# EAGLE design Medir-220-4 (EAGLE 7.2.0)
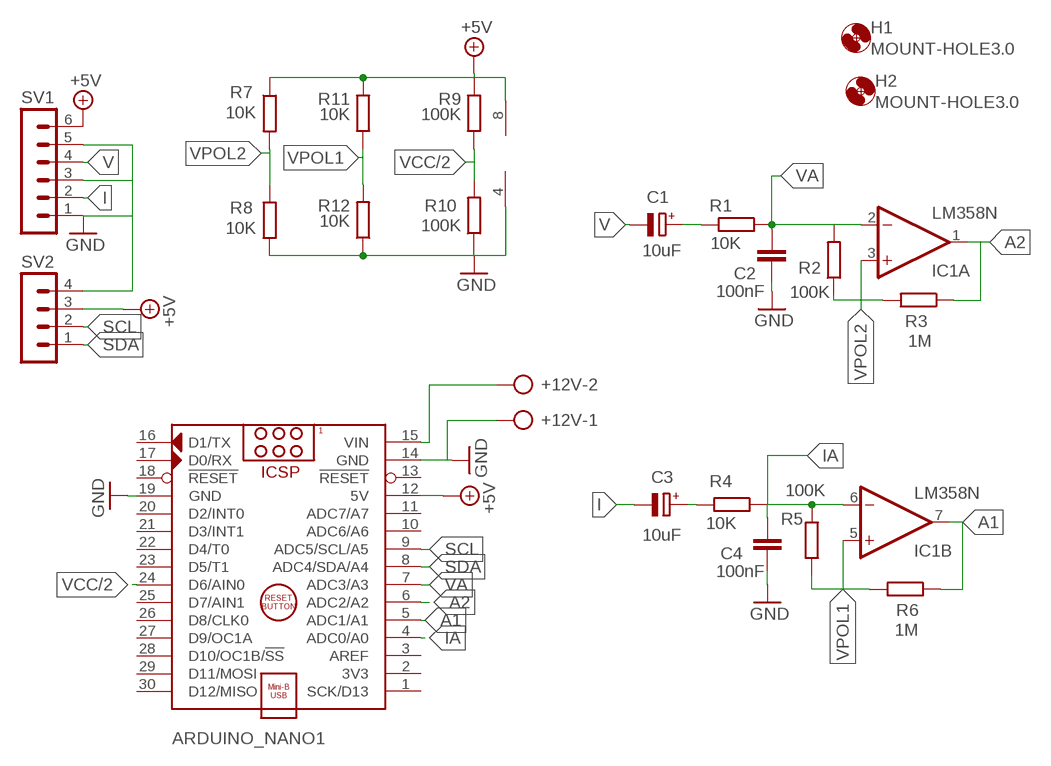
[diagram p0: schematic, sheet 1]

## Parts
+12V  AK500/2  [AK500/2]
ARDUINO_NANO1  ARDUINO_NANO  [ARDUINO_NANO]
C1  10uF  CPOL-EUE2.5-5  [E2,5-5]
C2  100nF  C-EU050-025X075  [C050-025X075]
C3  10uF  CPOL-EUE2.5-5  [E2,5-5]
C4  100nF  C-EU050-025X075  [C050-025X075]
H1  MOUNT-HOLE3.0  [3,0]
H2  MOUNT-HOLE3.0  [3,0]
IC1  LM358N  [DIL08]
R1  10K  R-EU_0207/7  [0207/7]
R2  100K  R-EU_0207/7  [0207/7]
R3  1M  R-EU_0207/7  [0207/7]
R4  10K  R-EU_0207/7  [0207/7]
R5  100K  R-EU_0207/7  [0207/7]
R6  1M  R-EU_0207/7  [0207/7]
R7  10K  R-EU_0207/7  [0207/7]
R8  10K  R-EU_0207/7  [0207/7]
R9  100K  R-EU_0207/10  [0207/10]
R10  100K  R-EU_0207/10  [0207/10]
R11  10K  R-EU_0207/7  [0207/7]
R12  10K  R-EU_0207/7  [0207/7]
SV1  MA06-1  [MA06-1]
SV2  MA04-1  [MA04-1]

## Nets
+5V: ARDUINO_NANO1.12(5V) IC1.8(P:V+) R7.1 R9.2 R11.2 SV1.6 SV2.3
A1: ARDUINO_NANO1.5(ADC1/A1) IC1.7(B:OUT) R6.1
A2: ARDUINO_NANO1.6(ADC2/A2) IC1.1(A:OUT) R3.1
GND: +12V.1 ARDUINO_NANO1.14(GND) ARDUINO_NANO1.19(GND) C2.2 C4.2 IC1.4(P:V-) R8.2 R10.1 R12.1 SV1.1 SV1.3 SV1.5 SV2.4
I: C3.- SV1.2
IA: ARDUINO_NANO1.4(ADC0/A0) C4.1 IC1.6(B:-IN) R4.1 R5.1
N$1: C3.+ R4.2
N$3: C1.+ R1.2
N$4: +12V.2 ARDUINO_NANO1.15(VIN)
SCL: ARDUINO_NANO1.9(ADC5/SCL/A5) SV2.2
SDA: ARDUINO_NANO1.8(ADC4/SDA/A4) SV2.1
V: C1.- SV1.4
VA: ARDUINO_NANO1.7(ADC3/A3) C2.1 IC1.2(A:-IN) R1.1 R2.2
VCC/2: ARDUINO_NANO1.24(D6/AIN0) R9.1 R10.2
VPOL1: IC1.5(B:+IN) R5.2 R6.2 R11.1 R12.2
VPOL2: IC1.3(A:+IN) R2.1 R3.2 R7.2 R8.1
Unconnected: ARDUINO_NANO1.1(SCK/D13) ARDUINO_NANO1.2(3V3) ARDUINO_NANO1.3(AREF) ARDUINO_NANO1.10(ADC6/A6) ARDUINO_NANO1.11(ADC7/A7) ARDUINO_NANO1.13(!RESET) ARDUINO_NANO1.16(D1/TX) ARDUINO_NANO1.17(D0/RX) ARDUINO_NANO1.18(!RESET) ARDUINO_NANO1.20(D2/INT0) ARDUINO_NANO1.21(D3/INT1) ARDUINO_NANO1.22(D4/T0) ARDUINO_NANO1.23(D5/T1) ARDUINO_NANO1.25(D7/AIN1) ARDUINO_NANO1.26(D8/CLK0) ARDUINO_NANO1.27(D9/OC1A) ARDUINO_NANO1.28(D10/OC1B/!SS) ARDUINO_NANO1.29(D11/MOSI) ARDUINO_NANO1.30(D12/MISO)

## Library data of the parts
+12V = con-ptr500:AK500/2: CONNECTOR; OC_FARNELL: unknown; OC_NEWARK: unknown
ARDUINO_NANO1 = ArduinoNanoV30:ARDUINO_NANO: Arduino Nano V3.0 Module Overview: The Arduino Nano is a small, complete, and breadboard-friendly board based on the ATmega328 (Arduino Nano 3.x) or ATmega168 (Arduino Nano 2.x). It has more or less the same functionality of the Arduino Duemilanove, but in a different package. It lacks only a DC power jack, and works with a Mini-B USB cable instead of a standard one. The Nano was designed and is being produced by Gravitech <http://www.gravitech.us/arna30wiatp.html>. General specifications: Item Value Microcontroller Atmel ATmega168 or ATmega328 Operating Voltage (logic level) 5 V Input Voltage (recommended) 7-12 V Input Voltage (limits) 6-20 V Digital I/O Pins 14 (of which 6 provide PWM output) Analog Input Pins 8 DC Current per I/O Pin 40 mA Flash Memory 16 KB (ATmega168) or 32 KB (ATmega328) of which 2 KB used by bootloader SRAM 1 KB (ATmega168) or 2 KB (ATmega328) EEPROM 512 bytes (ATmega168) or 1 KB (ATmega328) Clock Speed 16 MHz Dimensions (Inches) 0.73" x 1.70" Dimensions (mm) 18mm x 45mm Overall height About 9 mm (not including pins) Weigth 5 g Power: The Arduino Nano can be powered via the Mini-B USB connection, 6-20V unregulated external power supply (pin 30), or 5V regulated external power supply (pin 27). The power source is automatically selected to the highest voltage source. Memory: The ATmega168 has 16 KB of flash memory for storing code (of which 2 KB is used for the bootloader); the ATmega328 has 32 KB, (also with 2 KB used for the bootloader). The ATmega168 has 1 KB of SRAM and 512 bytes of EEPROM (which can be read and written with the EEPROM library); the ATmega328 has 2 KB of SRAM and 1 KB of EEPROM. Input and Output: Each of the 14 digital pins on the Nano can be used as an input or output, using pinMode(), digitalWrite(), and digitalRead() functions. They operate at 5 volts. Each pin can provide or receive a maximum of 40 mA and has an internal pull-up resistor (disconnected by default) of 20-50 kOhms. In addition, some pins have specialized functions. Visit Arduino - ArduinoBoardNano <https://www.arduino.cc/en/Main/ArduinoBoardNano>
C1 C3 = rcl:CPOL-EU: POLARIZED CAPACITOR, European symbol
C2 C4 = rcl:C-EU: CAPACITOR, European symbol
H1 H2 = holes:MOUNT-HOLE: MOUNTING HOLE with drill center marker
IC1 = linear:LM358: OP AMP also LM158; LM258; LM2904 Source: http://cache.national.com/ds/LM/LM158.pdf
R1-R8 R11 R12 = resistor:R-EU_: RESISTOR, European symbol
R9 R10 = rcl:R-EU_: RESISTOR, European symbol
SV1 = con-lstb:MA06-1: PIN HEADER; OC_FARNELL: unknown; OC_NEWARK: unknown
SV2 = con-lstb:MA04-1: PIN HEADER; OC_FARNELL: unknown; OC_NEWARK: unknown

## Board
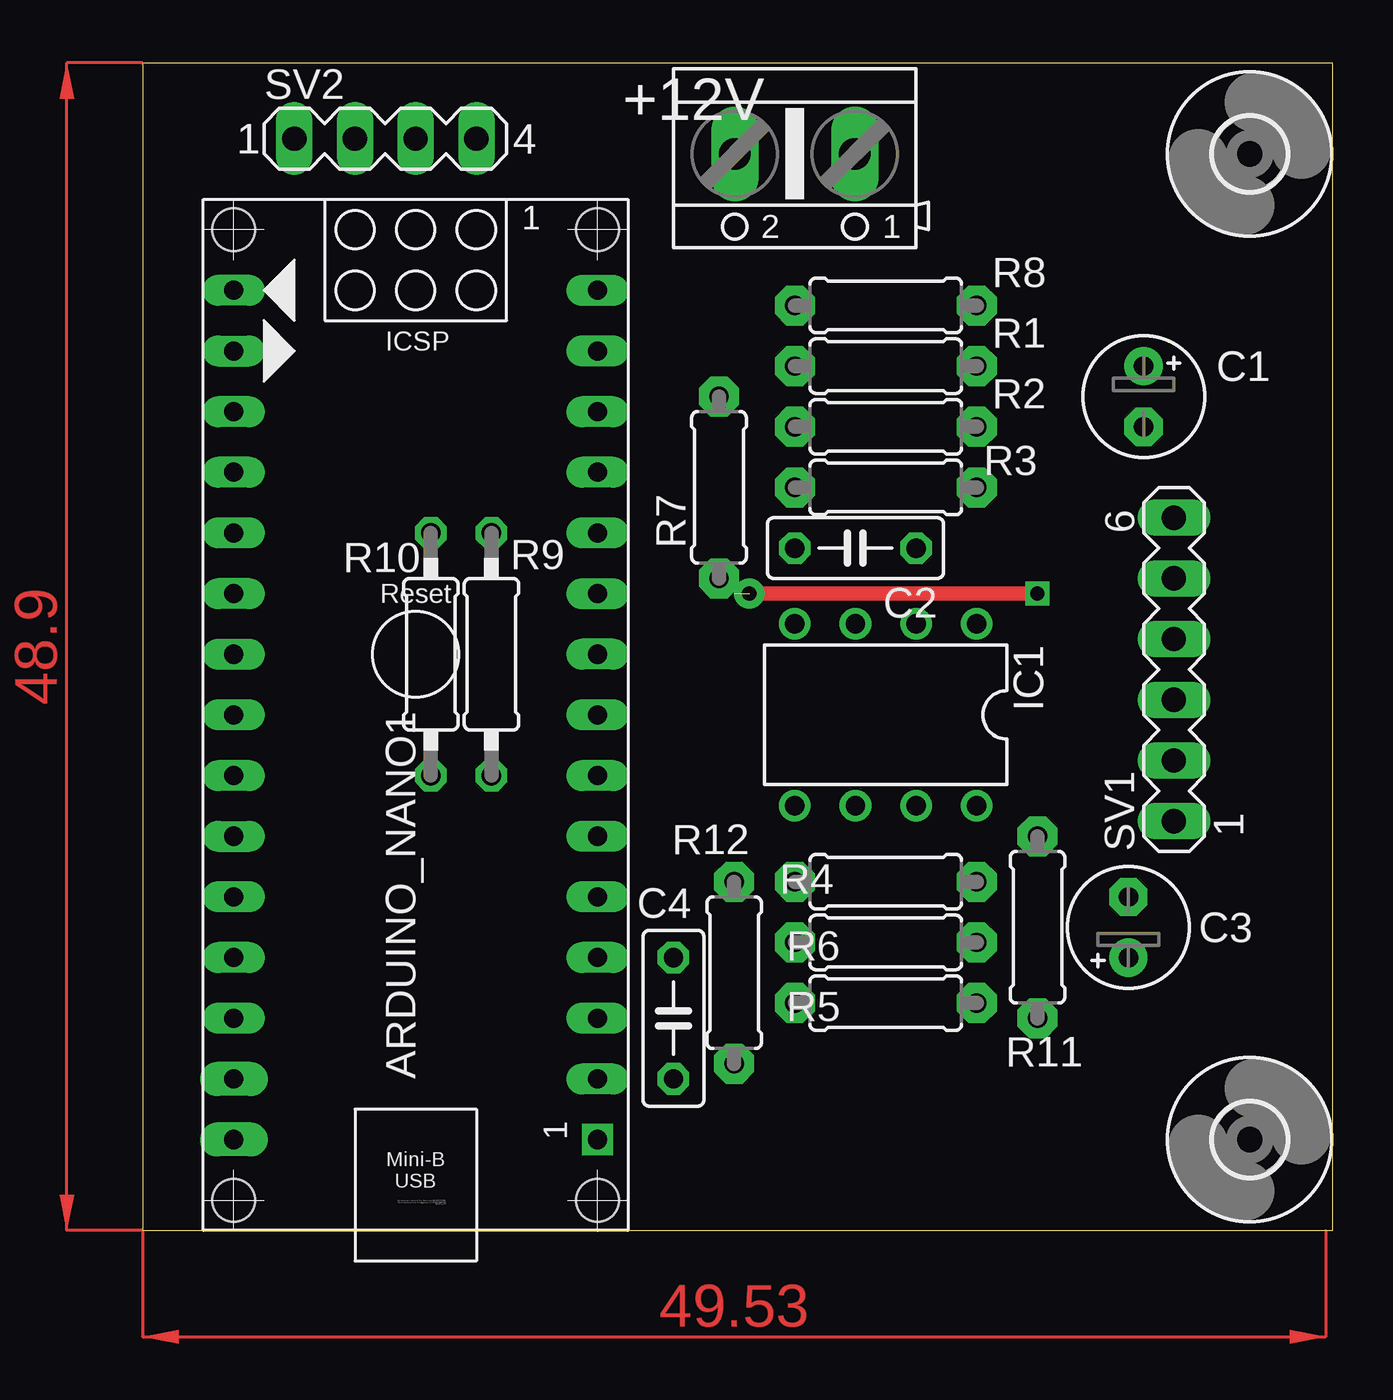
[diagram p1: board, top side]
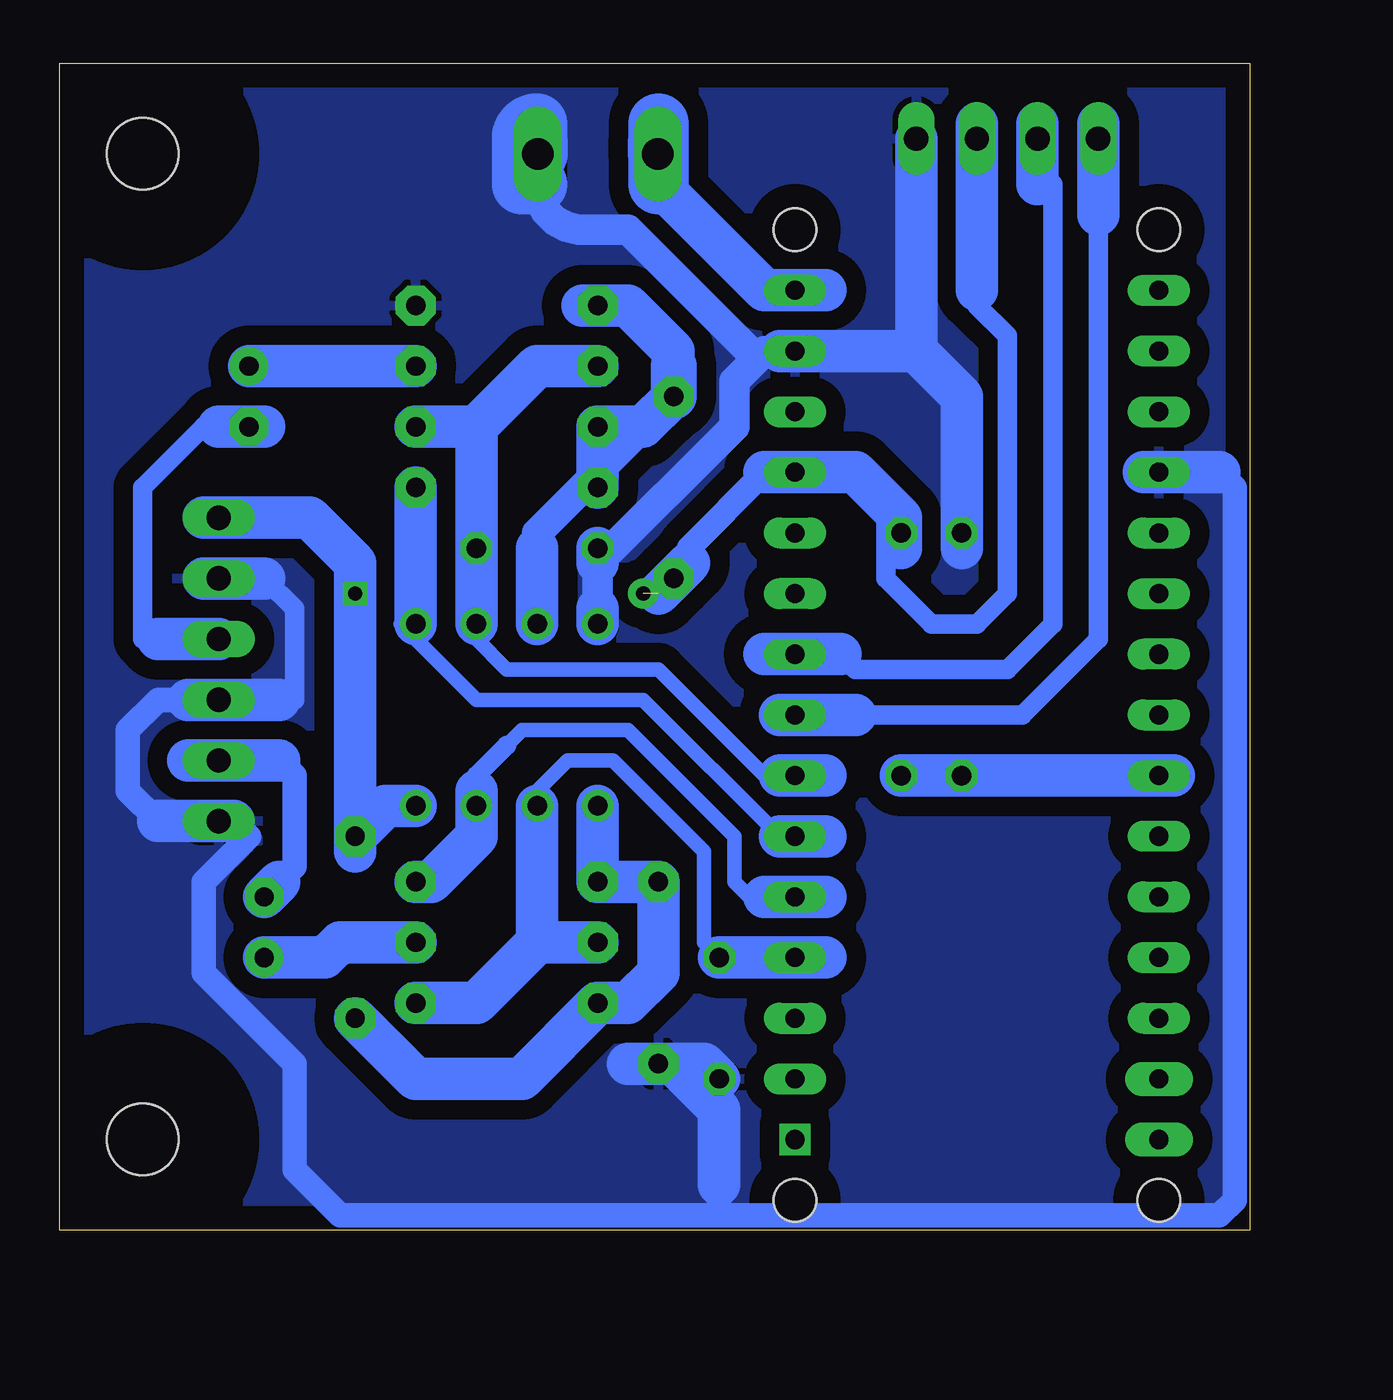
[diagram p2: board, bottom side, seen from below]

Size 49.84 x 48.88 mm. Coordinates in mm from the lower left corner, seen from the top.
Outline: 0,0 49.84,0 49.84,48.88 0,48.88 0,0
Copper layers (1*16): Top 0.035mm / dielectric 1.5mm / Bottom 0.035mm
Design rules "default": minimum track width 10mil, minimum drill 24mil, track to track 8mil, track to pad 8mil, pad to pad 8mil, via to via 8mil, smd to smd 8mil, copper to edge 40mil, drill to drill 8mil, minimum pad ring 10mil, minimum via ring 8mil, stop-mask expansion 4mil, vias tented up to drill 0mil, thermal gap 10mil

### Footprints (pad centres in the part's own frame; a part is rotated, then mirrored left to right if it is on the bottom)
AK500/2 = drill 1.321 long: 1 -2.515,0; 2 2.515,0
ARDUINO_NANO = drill 0.8 pad 1.27 square: 1 -20.32,-7.62 | drill 0.8 long: 2 -17.78,-7.62; 3 -15.24,-7.62; 4 -12.7,-7.62; 5 -10.16,-7.62; 6 -7.62,-7.62; 7 -5.08,-7.62; 8 -2.54,-7.62; 9 0,-7.62; 10 2.54,-7.62; 11 5.08,-7.62; 12 7.62,-7.62; 13 10.16,-7.62; 14 12.7,-7.62; 15 15.24,-7.62; 16 15.24,7.62; 17 12.7,7.62; 18 10.16,7.62; 19 7.62,7.62; 20 5.08,7.62; 21 2.54,7.62; 22 0,7.62; 23 -2.54,7.62; 24 -5.08,7.62; 25 -7.62,7.62; 26 -10.16,7.62; 27 -12.7,7.62; 28 -15.24,7.62 | drill 0.8 pad 1.422 long: 29 -17.78,7.62; 30 -20.32,7.62 | hole 1.778: -22.86,-7.62; -22.86,7.62; 17.78,7.62; 17.78,-7.62
E2,5-5 = drill 0.813 pad 1.6: + -1.27,0 | drill 0.813 pad 1.6 octagon: - 1.27,0
C050-025X075 = drill 0.813 octagon: 1 -2.54,0; 2 2.54,0
3,0 = hole 3: 0,0
DIL08 = drill 0.813 pad 1.27: 1 -3.81,-3.81; 2 -1.27,-3.81; 3 1.27,-3.81; 4 3.81,-3.81; 5 3.81,3.81; 6 1.27,3.81; 7 -1.27,3.81; 8 -3.81,3.81
0207/7 = drill 0.813 pad 1.676 octagon: 1 -3.81,0; 2 3.81,0
0207/10 = drill 0.813 octagon: 1 -5.08,0; 2 5.08,0
MA06-1 = drill 1.016 long: 1 -6.35,0; 2 -3.81,0; 3 -1.27,0; 4 1.27,0; 5 3.81,0; 6 6.35,0
MA04-1 = drill 1.016 long: 1 -3.81,0; 2 -1.27,0; 3 1.27,0; 4 3.81,0

### Placement (x,y rotation side)
+12V  27.3,45.09 180 top
ARDUINO_NANO1  11.43,24.13 90 top
C1  41.91,34.92 270 top
C2  29.84,28.57 180 top
C3  41.27,12.7 90 top
C4  22.23,8.89 270 top
H1  46.35,3.81 0 top
H2  46.35,45.09 0 top
IC1  31.11,21.59 180 top
R1  31.11,36.2 0 top
R2  31.11,33.66 0 top
R3  31.11,31.11 180 top
R4  31.11,12.06 0 top
R5  31.11,9.53 180 top
R6  31.11,14.61 180 top
R7  24.13,31.11 90 top
R8  31.11,38.73 0 top
R9  14.61,24.13 90 top
R10  12.06,24.13 270 top
R11  37.47,12.7 90 top
R12  24.77,10.79 90 top
SV1  43.18,23.5 90 top
SV2  10.16,45.72 0 top

### Tracks (layer width: path | path; a pad name or v marks a point on that pad's centre or on a via)
+5V  (via drill 0.6, 0.6 pad 1.27)  (1 unrouted)
  Top 0.61: v25.4,26.67 v37.47,26.67
  Bottom 0.813: 11.43,39.37 11.43,38.73 10.16,37.47 10.16,26.67 11.43,25.4 13.34,25.4 15.24,27.3 15.24,29.84 17.14,31.75
  Bottom 1.016: 23.5,27.94 23.5,28.57 20.32,31.75
  Bottom 1.778: 14.61,28.57 R9.2 14.61,29.84 16.51,31.75 17.14,31.75 ARDUINO_NANO1.12 20.32,31.75 | IC1.8 36.2,17.78 R11.2 | R11.2 v37.47,26.67 37.47,27.94 39.37,29.84 SV1.6 43.81,29.84 | 37.47,15.88 R11.2 | 23.5,27.94 R7.1 24.77,26.67 | 11.43,46.35 SV2.3 11.43,39.37
A1
  Bottom 0.61: 31.11,20.32 30.48,20.95 26.04,20.95 21.59,16.51 21.59,14.61 20.95,13.97 20.32,13.97
  Bottom 0.813: 32.38,18.41 32.38,19.05 31.11,20.32
  Bottom 1.778: R6.1 34.29,14.61 32.38,16.51 IC1.7 32.38,18.41 | 20.32,13.97 ARDUINO_NANO1.5 17.78,13.97
A2
  Bottom 0.61: 19.68,16.51 25.4,22.23 32.38,22.23 35.56,25.4 34.92,26.04
  Bottom 1.778: IC1.1 34.92,26.04 R3.1 | 17.78,16.51 ARDUINO_NANO1.6 19.68,16.51
GND
  Bottom 0.813: 41.27,27.3 40.01,26.04 40.01,22.23 40.64,22.23
  Bottom 1.016: 45.72,17.14 46.99,18.41 46.99,20.95 45.72,22.23 44.45,22.23 | 1.27,31.75 0.64,31.11 0.64,1.27 1.27,0.64 22.23,0.64 | 22.23,0.64 38.1,0.64 40.01,2.54 40.01,6.99 43.81,10.79 43.81,14.61 41.91,16.51 42.55,17.14 | 22.23,1.91 22.23,0.64
  Bottom 1.27: 19.68,36.83 20.32,36.83 20.64,36.51 | 20.64,36.51 21.59,35.56 21.59,33.66 27.3,27.94 27.3,26.04 | 29.84,43.81 arc-90 27.94,41.91 26.04,41.91 20.64,36.51
  Bottom 1.778: 43.81,27.3 SV1.5 41.27,27.3 | 40.64,22.23 SV1.3 44.45,22.23 | 42.55,17.14 SV1.1 45.72,17.14 | 27.3,27.94 C2.2 | 19.68,36.83 ARDUINO_NANO1.14 13.97,36.83 | 12.06,28.57 R10.1 12.06,34.92 13.97,36.83 | SV2.4 13.97,36.83 | 4.45,31.75 ARDUINO_NANO1.19 1.27,31.75 | R12.1 26.04,6.99 | R12.1 22.86,6.99 C4.2 | R12.1 24.13,6.99 22.23,5.08 22.23,1.91 | IC1.4 27.3,26.04
  Bottom 2.54: +12V.1 29.84,46.35 arc-90 30.48,45.72 30.48,43.81 29.84,43.81
  pour Bottom (isolate 0.813): 0,48.9 50.16,48.9 50.16,0 0,0
I
  Bottom 1.016: 40.64,14.61 40.01,15.24 40.01,19.05 40.64,19.68
  Bottom 1.778: C3.- 40.64,14.61 | 40.64,19.68 SV1.2 44.45,19.68
IA
  Bottom 0.61: C4.1 22.86,12.06 22.86,15.88 26.67,19.68 28.57,19.68 29.84,18.41 29.84,17.14
  Bottom 1.778: IC1.6 29.84,17.14 29.84,12.06 | 29.84,12.06 R4.1 | R5.1 32.38,9.53 29.84,12.06 | 17.78,11.43 ARDUINO_NANO1.4 C4.1
N$1
  Bottom 1.778: C3.+ 38.73,11.43 38.1,12.06 R4.2
N$2  (via drill 0.6)
  other vias: 37.47,26.67
N$3
  Bottom 1.778: R1.2 C1.+
N$4
  Bottom 1.778: 17.78,39.37 ARDUINO_NANO1.15 20.32,39.37 24.77,43.81
  Bottom 2.54: 24.77,43.81 24.77,46.35 +12V.2
SCL
  Bottom 0.813: 17.14,24.13 16.51,23.5 10.16,23.5 8.26,25.4 8.26,43.81 8.89,44.45
  Bottom 1.778: 20.32,24.13 ARDUINO_NANO1.9 17.14,24.13 | 8.89,43.81 8.89,44.45 SV2.2 8.89,46.35
SDA
  Bottom 0.813: 6.35,42.55 6.35,24.77 9.53,21.59 16.51,21.59
  Bottom 1.778: 6.35,46.35 SV2.1 6.35,42.55 | 16.51,21.59 ARDUINO_NANO1.8 19.68,21.59
V
  Bottom 0.813: 43.18,33.66 43.81,33.66 46.35,31.11 46.35,24.77 45.72,24.77
  Bottom 1.778: 41.27,33.66 C1.- 43.18,33.66 | 45.72,24.77 SV1.4
VA
  Bottom 0.61: IC1.2 32.38,24.77 31.11,23.5 24.77,23.5 20.32,19.05 19.68,19.05
  Bottom 1.778: R1.1 29.84,36.2 32.38,33.66 | 32.38,33.66 R2.2 | 32.38,33.66 C2.1 IC1.2 | 19.68,19.05 ARDUINO_NANO1.7 17.78,19.05
VCC/2
  Bottom 1.778: 3.17,19.05 ARDUINO_NANO1.24 R10.2 R9.1
VPOL1
  Bottom 1.778: R11.1 34.92,6.35 30.48,6.35 R5.2 26.04,9.53 24.77,10.79 R12.2 R6.2 IC1.5
VPOL2
  Bottom 1.27: 29.84,28.57 29.84,29.21 25.4,33.66
  Bottom 1.778: IC1.3 29.84,28.57 | R3.2 R2.1 25.4,33.66 R7.2 | 27.94,38.73 R8.1 26.04,38.73 24.13,36.83 24.13,36.2
  Bottom 1.93: 24.13,36.2 R7.2
(copper drawn outside any net)
  shapes: Top area x2